# Altium project V40_Test_Adapter.PrjPcb
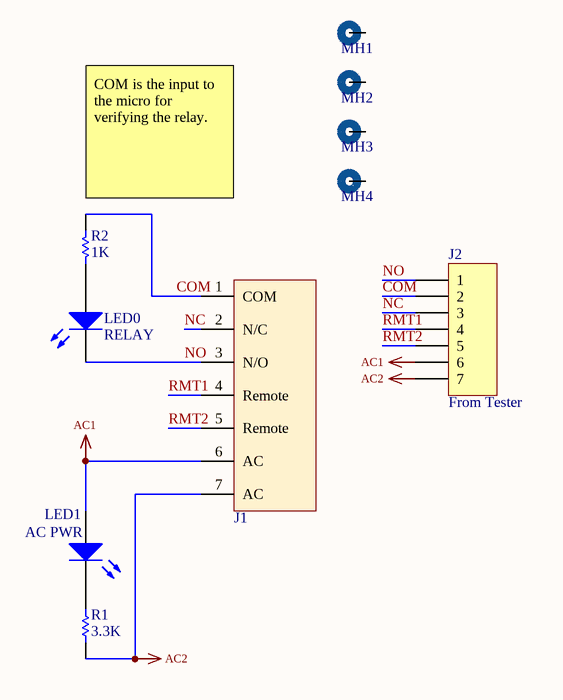
[diagram p0: V40_Test_Adapter.SchDoc]
engineer: DMH; title: V40_Test_Adapter
1 sheet, 10 parts. Net scope: global (net labels, ports and power ports of the same name join across sheets).
Board file: V40_Test_Adapter.PcbDoc

## Sheet V40_Test_Adapter.SchDoc: V40 Tester Adapter Board
size A4; CompanyName: Detex; Engineer: DMH; Address1: Detex Corp; Address2: 302 Detex Dr; Address3: New Braunfels, TX; Address4: (830) 629-290; DocumentNumber: ----; Revision: A0; SheetNumber: 1; SheetTotal: 1

### Parts
J1  Connector  [Phoenix Terminal Block]  (value not drawn)
J2  From Tester  [HDR1X7]
LED0  RELAY  [LED_2]
LED1  AC PWR  [LED_2]
MH1  Mounting Hole  [Mounting Hole]  (value not drawn)
MH2  Mounting Hole  [Mounting Hole]  (value not drawn)
MH3  Mounting Hole  [Mounting Hole]  (value not drawn)
MH4  Mounting Hole  [Mounting Hole]  (value not drawn)
R1  3.3K  [AXIAL-0.3]
R2  value 1K  [AXIAL-0.3]  (hidden comment: 3.3K)

### Nets
AC1: J1.6(AC) J2.6 LED1.1(A)
AC2: J1.7(AC) J2.7 R1.2
COM: J1.1(COM) J2.2 R2.2
NC: J1.2(N/C) J2.3
NO: J1.3(N/O) J2.1 LED0.2(K)
RMT1: J1.4(Remote) J2.4
RMT2: J1.5(Remote) J2.5
NetLED0_1: LED0.1(A) R2.1
NetLED1_2: LED1.2(K) R1.1

Not connected (* = marked no-connect by the designer): MH1 0; MH2 0; MH3 0; MH4 0

### Notes on the sheet
- (near R2) COM is the input to the micro for verifying the relay.
- Title
- Size:
- Date:
- A4
- Number:
- Time:
- Revision:
- Sheet
- of
- File:

### Library data of the parts
J2 = Header 7: Header, 7-Pin; LatestRevisionDate: 17-Jul-2002; LatestRevisionNote: Re-released for DXP Platform.; Publisher: Altium Limited
LED0 LED1 = LED0: Typical INFRARED GaAs LED; Published: 8-Jun-2000; LatestRevisionDate: 08-Jul-2005; LatestRevisionNote: Mech Layer 1 removed.; PackageReference: LED-0; Publisher: Altium Limited; PackageDescription: LED; 2 Leads
R1 R2 = Res1: Resistor; Published: 8-Jun-2000; LatestRevisionDate: 17-Jul-2002; LatestRevisionNote: Re-released for DXP Platform.; PackageReference: AXIAL-0.3; Publisher: Altium Limited; PackageDescription: Axial Device, Thru-Hole; 2 Leads; 0.3 in Pin Spacing
  R1: Value: 3.3K